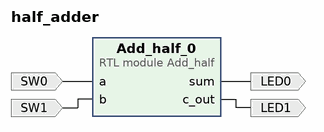
[diagram p0: block diagram of the top level]
# Vivado block design half_adder, xc7z020clg400-1, Vivado 2022.2
create_bd_design half_adder

create_bd_port -dir O LED0
create_bd_port -dir O LED1
create_bd_port -dir I SW0
create_bd_port -dir I SW1

create_bd_cell -type module -reference Add_half Add_half_0

# ---- connections ----

connect_bd_net [get_bd_pins Add_half_0/c_out] [get_bd_ports LED1]
connect_bd_net [get_bd_pins Add_half_0/sum] [get_bd_ports LED0]
connect_bd_net -net SW0_1 [get_bd_ports SW0] [get_bd_pins Add_half_0/a]
connect_bd_net -net SW1_1 [get_bd_ports SW1] [get_bd_pins Add_half_0/b]

validate_bd_design
save_bd_design
